# EAGLE design connector (EAGLE 6.5.0)
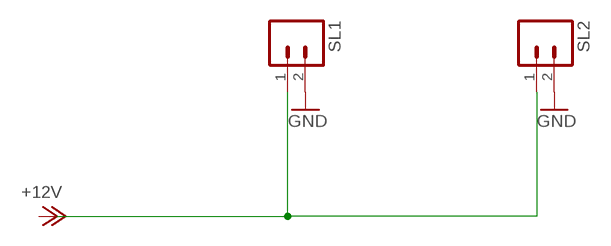
[diagram p0: schematic, sheet 1]

## Parts
SL1  M02  [02P]
SL2  M02  [02P]

## Nets
GND: SL1.2 SL2.2
N$1: SL1.1 SL2.1

## Library data of the parts
SL1 SL2 = con-amp-quick:M02: AMP QUICK CONNECTOR; OC_FARNELL: unknown; OC_NEWARK: unknown

## Board
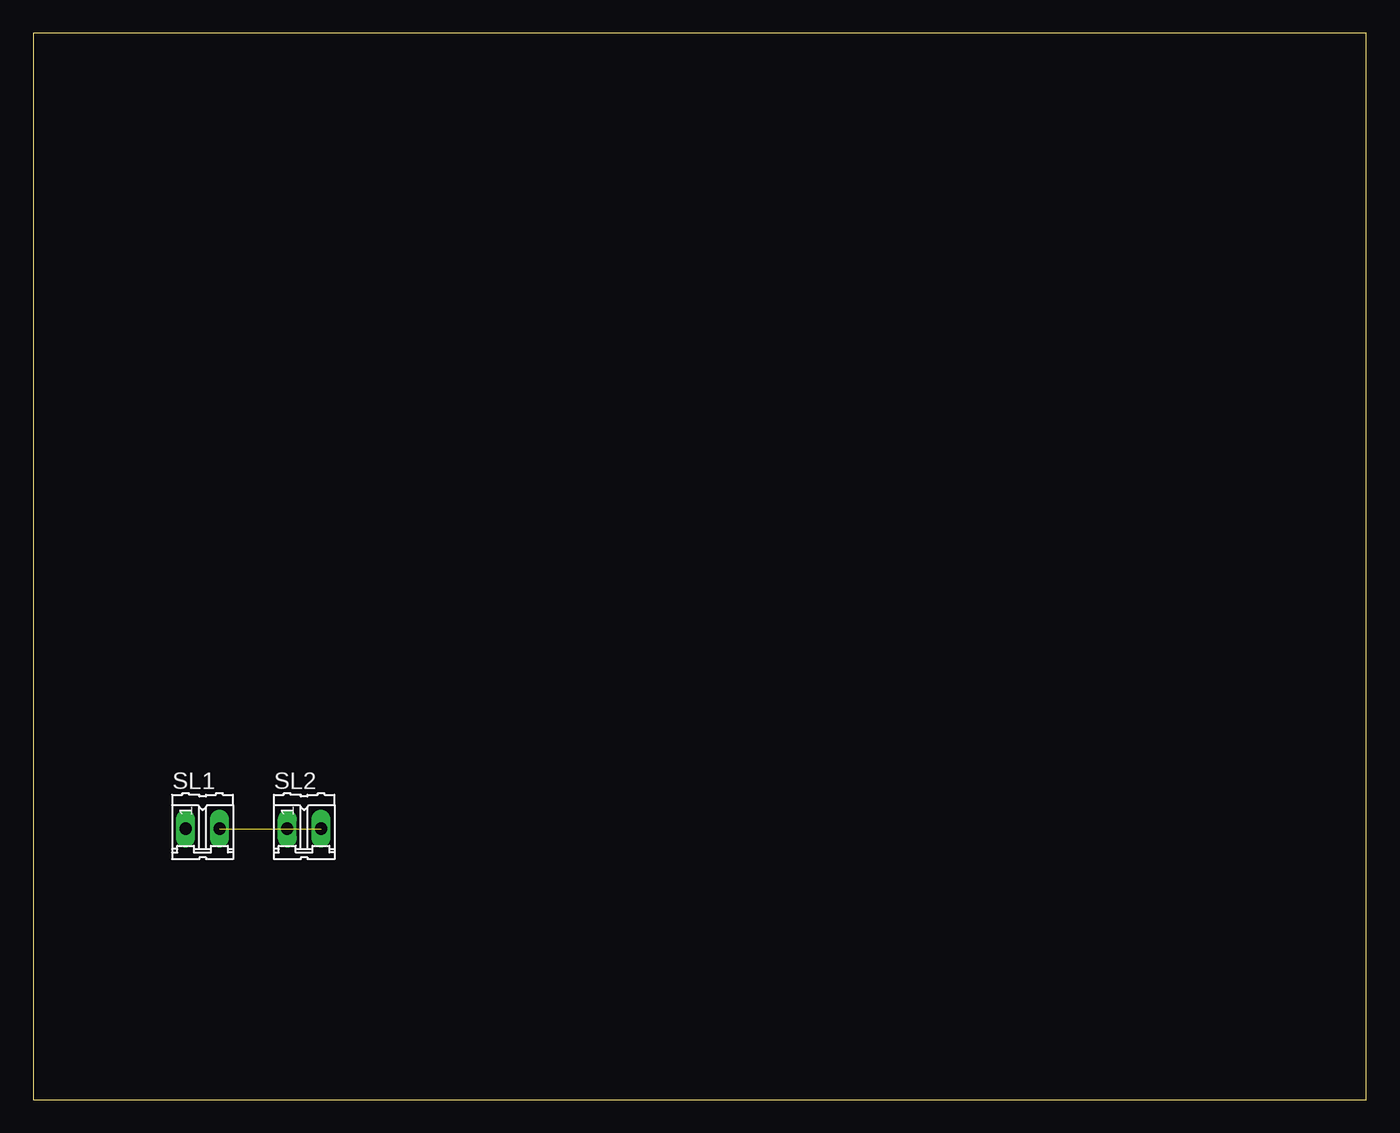
[diagram p1: board, top side]
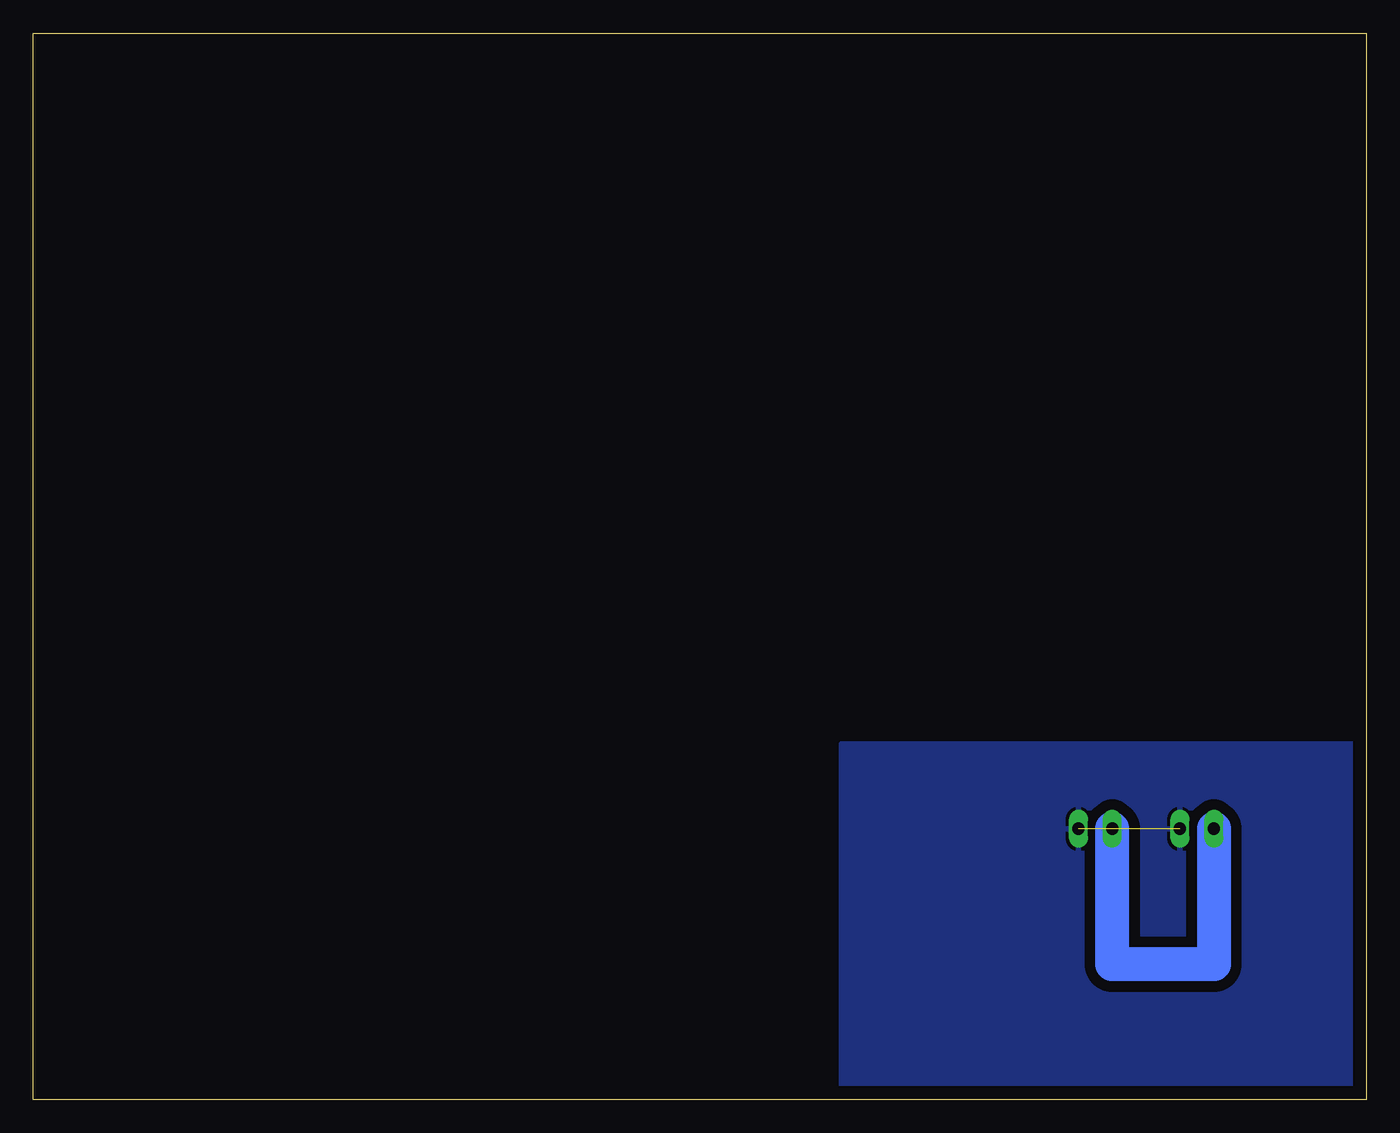
[diagram p2: board, bottom side, seen from below]

Size 100 x 80 mm. Coordinates in mm from the lower left corner, seen from the top.
Outline: 0,0 100,0 100,80 0,80 0,0
Copper layers (1*16): Top 0.035mm / dielectric 1.5mm / Bottom 0.035mm
Design rules "default": minimum track width 10mil, minimum drill 24mil, track to track 8mil, track to pad 8mil, pad to pad 8mil, via to via 8mil, smd to smd 8mil, copper to edge 40mil, drill to drill 8mil, minimum pad ring 10mil, minimum via ring 8mil, stop-mask expansion 4mil, vias tented up to drill 0mil, thermal gap 10mil

### Footprints (pad centres in the part's own frame; a part is rotated, then mirrored left to right if it is on the bottom)
02P = drill 0.914 long: 1 -1.27,0; 2 1.27,0

### Placement (x,y rotation side)
SL1  12.7,20.32 0 top
SL2  20.32,20.32 0 top

### Tracks (layer width: path | path; a pad name or v marks a point on that pad's centre or on a via)
GND  (1 unrouted)
  pour Bottom (isolate 0.813): 0,26.67 39.37,26.67 39.37,0 0,0
N$1
  Bottom 2.54: SL1.1 11.43,10.16 19.05,10.16 SL2.1